# EAGLE schematic breakout_mdbt40 (EAGLE 7.2.0)
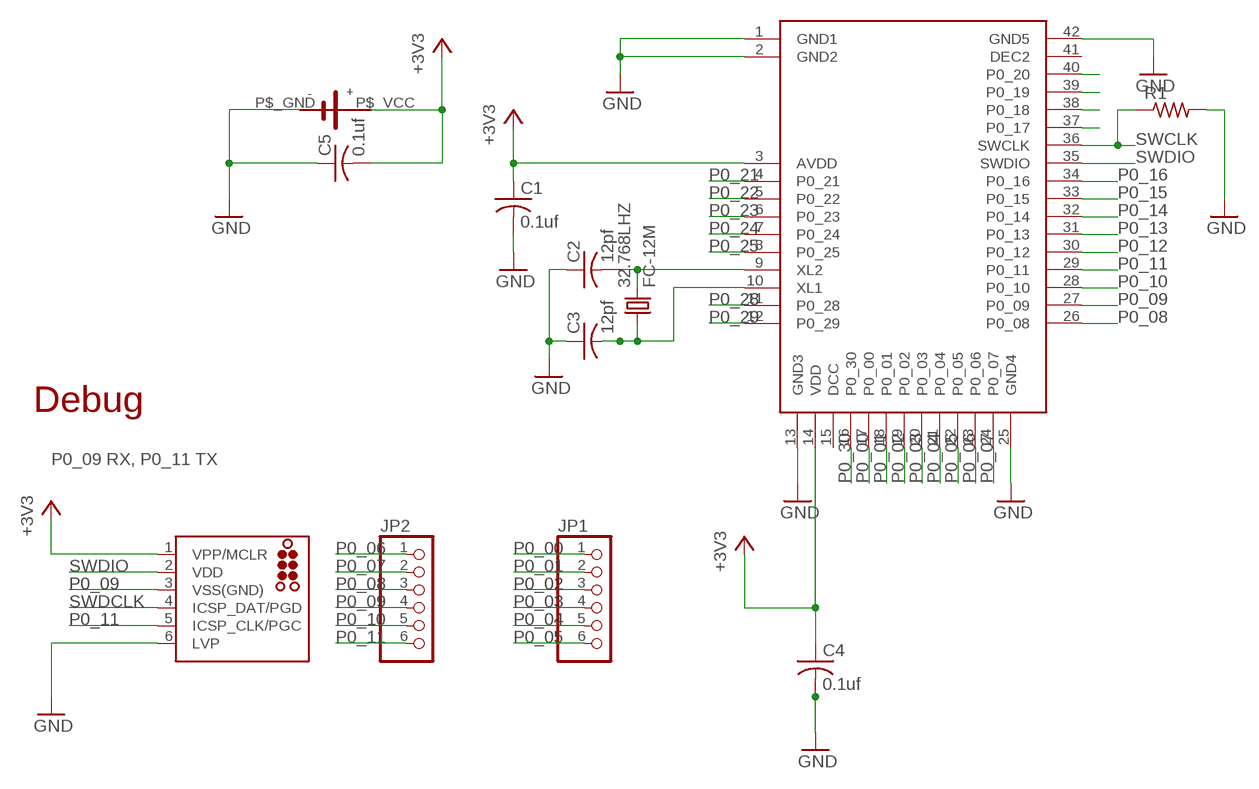
[diagram p0: schematic, sheet 1]

## Parts
32.768LHZ  FC-12M  [FC-12M]
C1  0.1uf  C-USC0603  [C0603]
C2  12pf  C-USC0603  [C0603]
C3  12pf  C-USC0603  [C0603]
C4  0.1uf  C-USC0603  [C0603]
C5  0.1uf  C-USC0603  [C0603]
J2  TC2030-MCP  [TC2030-MCP]
JP1  PINHD-1X6  [1X06]
JP2  PINHD-1X6  [1X06]
R1  R-US_R0603  [R0603]
U$1  RAYTAC-MDBT40  [RAYTAC-MDBT40]
U$3  SMTU2450-BOTTOM-MINI  [SMTU2450-BOTTOM-MINI]

## Nets
+3V3: C1.1 C4.1 C5.2 J2.1(VPP/MCLR) U$1.3(AVDD) U$1.14(VDD) U$3.P$_VCC
GND: C1.2 C2.1 C3.1 C4.2 C5.1 J2.6(LVP) R1.2 U$1.1(GND1) U$1.2(GND2) U$1.13(GND3) U$1.25(GND4) U$1.42(GND5) U$3.P$_GND
N$7: 32.768LHZ.2 C2.2 U$1.9(XL2)
N$8: 32.768LHZ.1 C3.2 U$1.10(XL1)
N$21: U$1.37(P0_17)
N$22: U$1.38(P0_18)
N$23: U$1.39(P0_19)
N$24: U$1.40(P0_20)
P0_00: JP1.1 U$1.17(P0_00)
P0_01: JP1.2 U$1.18(P0_01)
P0_02: JP1.3 U$1.19(P0_02)
P0_03: JP1.4 U$1.20(P0_03)
P0_04: JP1.5 U$1.21(P0_04)
P0_05: JP1.6 U$1.22(P0_05)
P0_06: JP2.1 U$1.23(P0_06)
P0_07: JP2.2 U$1.24(P0_07)
P0_08: JP2.3 U$1.26(P0_08)
P0_09: J2.3(VSS(GND)) JP2.4 U$1.27(P0_09)
P0_10: JP2.5 U$1.28(P0_10)
P0_11: J2.5(ICSP_CLK/PGC) JP2.6 U$1.29(P0_11)
P0_12: U$1.30(P0_12)
P0_13: U$1.31(P0_13)
P0_14: U$1.32(P0_14)
P0_15: U$1.33(P0_15)
P0_16: U$1.34(P0_16)
P0_21: U$1.4(P0_21)
P0_22: U$1.5(P0_22)
P0_23: U$1.6(P0_23)
P0_24: U$1.7(P0_24)
P0_25: U$1.8(P0_25)
P0_28: U$1.11(P0_28)
P0_29: U$1.12(P0_29)
P0_30: U$1.16(P0_30)
SWCLK: R1.1 U$1.36(SWCLK)
SWDCLK: J2.4(ICSP_DAT/PGD)
SWDIO: J2.2(VDD) U$1.35(SWDIO)
Unconnected: U$1.15(DCC) U$1.41(DEC2)

## Notes on the sheet
- Debug
- P0_09 RX, P0_11 TX

## Library data of the parts
32.768LHZ = crystal:FC-12M: kHz RANGE CRYSTAL UNIT LOW PROFILE SMD Source: Epson Toyocom FC-12M.pdf
C1-C5 = adafruit:C-US: CAPACITOR, American symbol
J2 = tag-connect:TC2030: TAG-CONNECT ICSP Connector Manufacturer: Tag-Connect <http://www.tag-connect.com> Cable for easy In-Circuit Serial Programming. Designed for Microchip ICD2, suitable for many others. Two variants - one "with legs" (for hands-free fit on PCB) and another "without legs" for quick programming. PAD Description 1 MCLR/Vpp 2 Vdd 3 GND 4 PGD (ISPDAT) 5 PGC (ISPCLK) 6 nc (used for LVP) ©2009 ROFA.cz - modified and updated by Robert Darlington ‹rdarlington@gmail.com›
JP1 JP2 = adafruit:PINHD-1X6: PIN HEADER
R1 = adafruit:R-US_: RESISTOR, American symbol
U$1 = gclueBT:RAYTAC-MDBT40
U$3 = gclue:SMTU2450-BOTTOM-MINI